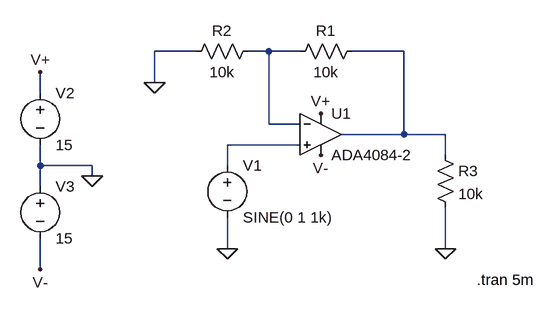
[diagram p0: schematic ADA4084-2.asc]
ADA4084-2.asc, the LTspice schematic file:
Version 4
SHEET 1 880 680
WIRE 48 32 -16 32
WIRE 160 32 128 32
WIRE 208 32 160 32
WIRE 368 32 288 32
WIRE -16 80 -16 32
WIRE -192 96 -192 64
WIRE 160 144 160 32
WIRE 208 144 160 144
WIRE 368 160 368 32
WIRE 368 160 272 160
WIRE 432 160 368 160
WIRE 208 176 96 176
WIRE 432 192 432 160
WIRE -192 208 -192 176
WIRE -112 208 -192 208
WIRE 96 208 96 176
WIRE -112 224 -112 208
WIRE -192 240 -192 208
WIRE 96 336 96 288
WIRE 432 336 432 272
WIRE -192 368 -192 320
FLAG 96 336 0
FLAG 432 336 0
FLAG -16 80 0
FLAG 240 128 V+
FLAG 240 192 V-
FLAG -112 224 0
FLAG -192 64 V+
FLAG -192 368 V-
SYMBOL ADA4084-2 240 96 R0
SYMATTR InstName U1
SYMBOL res 304 16 R90
WINDOW 0 0 56 VBottom 2
WINDOW 3 32 56 VTop 2
SYMATTR InstName R1
SYMATTR Value 10k
SYMBOL res 144 16 R90
WINDOW 0 0 56 VBottom 2
WINDOW 3 32 56 VTop 2
SYMATTR InstName R2
SYMATTR Value 10k
SYMBOL voltage 96 192 R0
WINDOW 123 0 0 Left 0
WINDOW 39 0 0 Left 0
SYMATTR InstName V1
SYMATTR Value SINE(0 1 1k)
SYMBOL res 416 176 R0
SYMATTR InstName R3
SYMATTR Value 10k
SYMBOL voltage -192 80 R0
WINDOW 123 0 0 Left 0
WINDOW 39 0 0 Left 0
SYMATTR InstName V2
SYMATTR Value 15
SYMBOL voltage -192 224 R0
WINDOW 123 0 0 Left 0
WINDOW 39 0 0 Left 0
SYMATTR InstName V3
SYMATTR Value 15
TEXT 480 384 Left 2 !.tran 5m

The netlist it stands for:
* ADA4084-2.asc
* U1: ADA4084-2 (symbol ADA4084-2 not available, pins judged from their places): In+=N003 In-=N001 V+=V+ V-=V- OUT=N002
R1 N002 N001 10k
R2 N001 0 10k
V1 N003 0 SINE(0 1 1k)
R3 N002 0 10k
V2 V+ 0 15
V3 0 V- 15
.tran 5m
.backanno
.end